# EAGLE design riffle-CT-beta-0.1.0 (EAGLE 7.3.0)
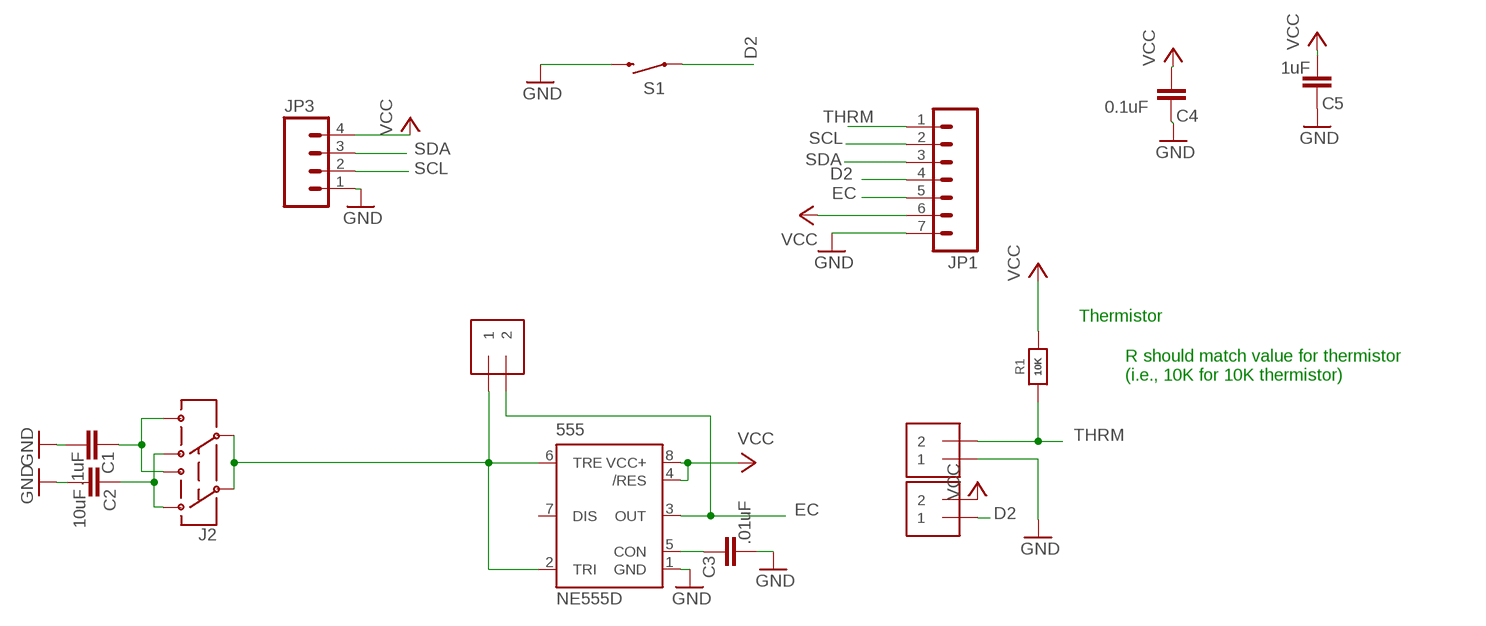
[diagram p0: schematic, sheet 1]

## Parts
1W  1X2-3.5MM  [1X2-3.5MM]
555  NE555D  [SO08@1]
C1  .1uF  CAP0603-CAP  [0603-CAP]
C2  10uF  CAP0603-CAP  [0603-CAP]
C3  .01uF  CAP0603-CAP  [0603-CAP]
C4  0.1uF  CAP0603-CAP  [0603-CAP]
C5  1uF  CAP0603-CAP  [0603-CAP]
EC  1X2-3.5MM  [1X2-3.5MM]
J2  AYZ0202  [AYZ0202]
JP1  M07  [1X07]
JP3  M04SMD  [1X04-SMD]
R1  10K  RESISTOR_0603_NOOUT  [0603-NO]
S1  REED  SWITCH-MOMENTARY-2PTH_REED2  [REED_SWITCH_PLASTIC]
THRM  1X2-3.5MM  [1X2-3.5MM]

## Nets
D2: 1W.1 JP1.4 S1.P$1
EC: 555.3(OUT) EC.2 JP1.5
GND: 555.1(GND) C1.1 C2.1 C3.1 C4.2 C5.2 JP1.7 JP3.1 S1.P$2 THRM.1
N1: 555.2(TRI) 555.6(TRE) EC.1 J2.2 J2.5
N$1: 555.5(CON) C3.2
N$6: C2.2 J2.3 J2.6
SCL: JP1.2 JP3.2
SDA: JP1.3 JP3.3
THRM: JP1.1 R1.1 THRM.2
VCC: 1W.2 555.4(/RES) 555.8(VCC+) C4.1 C5.1 JP1.6 JP3.4 R1.2
VDD2: C1.2 J2.1 J2.4
Unconnected: 555.7(DIS)

## Notes on the sheet
- Thermistor
- R should match value for thermistor
  (i.e., 10K for 10K thermistor)

## Library data of the parts
1W EC THRM = adafruit:1X2: 3.5mm Terminal block http://www.ladyada.net/library/pcb/eaglelibrary.html
555 = SparkFun-AnalogIC:NE555: General purpose bipolar Timer
C1-C5 = SparkFun:CAP: Capacitor Standard 0603 ceramic capacitor, and 0.1" leaded capacitor.
J2 = SparkFunNew:AYZ0202: SPDT Slide Switch Simple SMD single-pull double-throw slide switch. Good for less than 350mA power switch, switching UARTs between devices, etc. Spark Fun Electronics SKU : COM-00597
JP1 = SparkFun-Connectors:M07: Header 7 Standard 7-pin 0.1" header. Use with straight break away headers (SKU : PRT-00116), right angle break away headers (PRT-00553), swiss pins (PRT-00743), machine pins (PRT-00117), and female headers (PRT-00115). NOTES ON THE VARIANTS LOCK and LOCK_LONGPADS... This footprint was designed to help hold the alignment of a through-hole component (i.e. 7-pin header) while soldering it into place. You may notice that each hole has been shifted either up or down by 0.005 of an inch from it's more standard position (which is usually a perfectly straight line). This slight alteration caused the pins (the squares in the middle) to touch the edges of the holes. Because they are alternating, it causes a "brace" to hold the header in place. 0.005 has proven to be the perfect amount of "off-center" position when using our standard breakaway headers. Although looks a little odd when you look at the bare footprint, once you have a header in there, the alteration is very hard to notice. Also, if you push a header all the way into place, it is covered up entirely on the bottom side. This idea of altering the position of holes to aid alignment will be further integrated into the Sparkfun Library for other footprints. It can help hold any component with 3 or more connection pins.
JP3 = SparkFun:M04: Header 4 Standard 4-pin 0.1" header. Use with straight break away headers (SKU : PRT-00116), right angle break away headers (PRT-00553), swiss pins (PRT-00743), machine pins (PRT-00117), and female headers (PRT-00115). Molex polarized connector foot print use with SKU : PRT-08231 with associated crimp pins and housings.
R1 = microbuilder:RESISTOR: Resistors For new designs, use the packages preceded by an '_' character since they are more reliable: The following footprints should be used on most boards: _0402 - Standard footprint for regular board layouts _0603 - Standard footprint for regular board layouts _0805 - Standard footprint for regular board layouts _1206 - Standard footprint for regular board layouts For extremely tight-pitch boards where space is at a premium, the following 'micro-pitch' footprints can be used (smaller pads, no silkscreen outline, etc.): _0402MP - Micro-pitch footprint for very dense/compact boards _0603MP - Micro-pitch footprint for very dense/compact boards _0805MP - Micro-pitch footprint for very dense/compact boards _1206MP - Micro-pitch footprint for very dense/compact boards
S1 = SparkFun-Electromechanical:SWITCH-MOMENTARY-2: Various NO switches- pushbuttons, reed, etc; PROD_ID: SWCH-10467

## Board
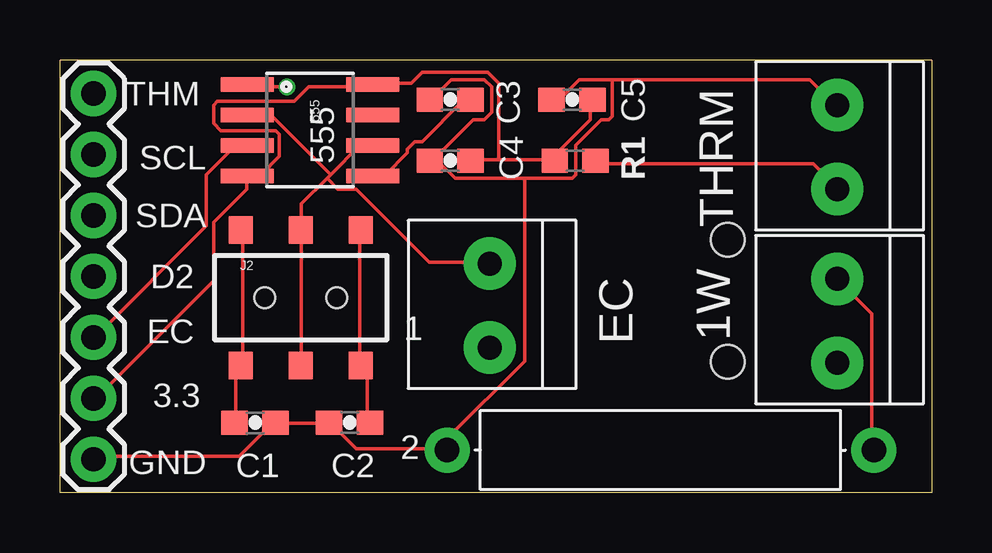
[diagram p1: board, top side]
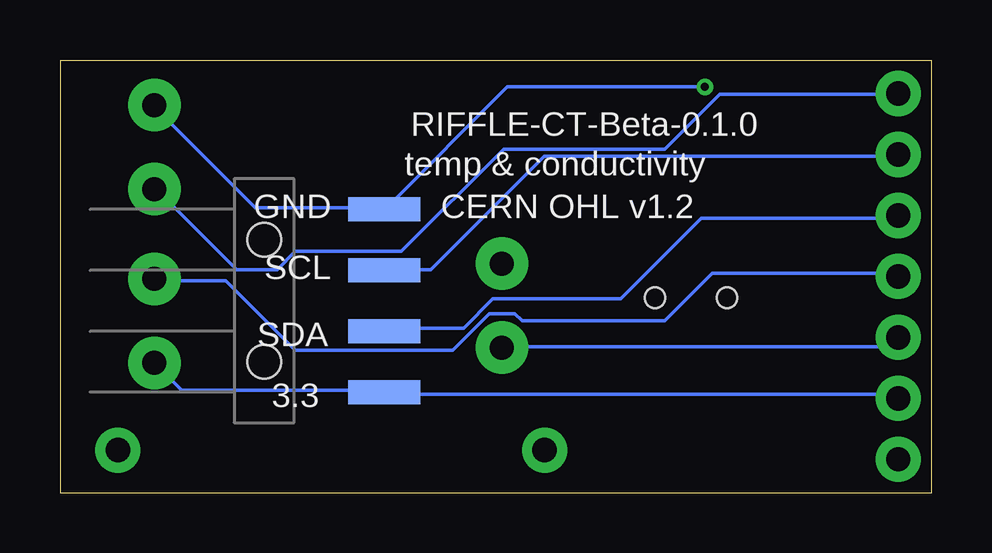
[diagram p2: board, bottom side, seen from below]

Size 36.32 x 18.03 mm. Coordinates in mm from the lower left corner, seen from the top.
Outline: 36.32,0 0,0 0,18.03 36.32,18.03 36.32,0
Copper layers (1*16): Top 0.0356mm / dielectric 1.5011mm / Bottom 0.0356mm
Design rules "LaenPCBOrder": minimum track width 6mil, minimum drill 13mil, track to track 6mil, track to pad 6mil, pad to pad 6mil, via to via 6mil, smd to smd 6mil, copper to edge 15mil, drill to drill 6mil, minimum pad ring 7mil, minimum via ring 7mil, stop-mask expansion 3mil, vias tented up to drill 0mil, thermal gap 10mil

### Footprints (pad centres in the part's own frame; a part is rotated, then mirrored left to right if it is on the bottom)
1X2-3.5MM = drill 1 pad 2.184: 1 1.8,0; 2 -1.7,0
SO08@1 = smd 0.61 x 2.21: 1 -1.905,-2.616; 2 -0.635,-2.616; 3 0.635,-2.616; 4 1.905,-2.616; 5 1.905,2.616; 6 0.635,2.616; 7 -0.635,2.616; 8 -1.905,2.616
0603-CAP = smd 1.1 x 1: 1 -0.85,0; 2 0.85,0
AYZ0202 = smd 1 x 1.15: 1 -2.5,2.825; 2 0,2.825; 3 2.5,2.825; 4 -2.5,-2.825; 5 0,-2.825; 6 2.5,-2.825 | hole 0.85: 1.5,0; -1.5,0
1X07 = drill 1.016 pad 1.88: 1 0,0; 2 2.54,0; 3 5.08,0; 4 7.62,0; 5 10.16,0; 6 12.7,0; 7 15.24,0
1X04-SMD = smd 1 x 3: 1 -3.81,5; 2 -1.27,5; 3 1.27,5; 4 3.81,5 | hole 1.4: -2.54,0; 2.54,0
0603-NO = smd 1.1 x 1: 1 -0.85,0; 2 0.85,0
REED_SWITCH_PLASTIC = drill 1.016 pad 1.88: P$1 -8.89,0; P$2 8.89,0

### Placement (x,y rotation side)
1W  32.38,7.11 90 top
555  10.41,15.11 270 top
C1  8.13,2.92 180 top
C2  12.06,2.92 0 top
C3  16.26,16.38 0 top
C4  16.26,13.84 180 top
C5  21.34,16.38 180 top
EC  17.91,7.75 90 top
J2  10.03,8.13 0 top
JP1  1.4,16.64 270 top
JP3  27.81,8 270 bottom
R1  21.46,13.84 180 top
S1  25.02,1.78 180 top
THRM  32.38,14.35 90 top

### Tracks (layer width: path | path; a pad name or v marks a point on that pad's centre or on a via)
D2
  Top 0.152: S1.P$1 33.83,1.83 33.83,7.47 32.46,8.84 1W.1
  Bottom 0.152: JP1.4 1.52,9.14 9.14,9.14 11.12,7.16 17.07,7.16 17.37,7.47 18.44,7.47 19.96,5.94 26.52,5.94 29.41,8.84 32.31,8.84 1W.1
EC
  Top 0.152: 555.3 7.32,14.48 6.1,13.26 6.1,11.12 1.52,6.55 JP1.5
  Bottom 0.152: EC.2 17.83,6.1 1.83,6.1 1.52,6.4 JP1.5
GND  (via drill 0.33)
  Top 0.152: 7.77,17.07 555.1 7.92,16.92 v9.45,16.92 | JP1.7 1.52,1.52 7.47,1.52 8.84,2.9 C1.1 8.99,2.9 11.12,2.9 C2.1 11.28,2.9 12.34,1.83 16,1.83 S1.P$2 16.15,1.83 16.15,2.29 19.36,5.49 19.36,13.11 | C3.1 15.54,16.46 16.31,17.22 17.68,17.22 17.98,16.92 17.98,15.85 17.68,15.54 17.22,15.54 15.54,13.87 C4.2 15.54,13.72 15.85,13.72 16.46,13.11 19.36,13.11 | 23.01,17.22 31.24,17.22 32.31,16.15 THRM.1 | 23.01,17.22 21.64,17.22 20.88,16.46 20.57,16.46 C5.2 | 19.36,13.11 21.34,13.11 21.49,13.26 21.49,14.48 22.55,15.54 22.86,15.54 23.01,15.7 23.01,17.22
  Bottom 0.152: v9.45,16.92 17.68,16.92 22.71,11.89 JP3.1 22.86,11.89 28.19,11.89 32.31,16 THRM.1
N1
  Top 0.152: J2.5 10.06,5.33 10.06,10.82 J2.2 10.06,10.97 10.06,12.04 11.12,13.11 | 555.6 12.5,14.48 11.28,13.26 | 11.12,13.11 11.28,13.26 | 11.28,13.26 8.84,15.7 7.92,15.7 555.2 | 11.12,13.11 11.58,12.65 12.34,12.65 15.39,9.6 17.83,9.6 EC.1
N$1
  Top 0.152: C3.2 17.07,16.31 16.76,16.31 15.09,14.63 14.78,14.63 14.48,14.33 14.48,14.17 13.56,13.26 13.11,13.26 555.5
N$6
  Top 0.152: C2.2 12.8,3.05 12.8,5.03 12.65,5.18 J2.6 12.5,5.33 12.5,10.82 J2.3
SCL
  Bottom 0.152: JP3.2 22.71,9.3 20.88,9.3 16.15,14.02 1.52,14.02 JP1.2
SDA
  Bottom 0.152: JP3.3 22.71,6.86 19.51,6.86 18.29,8.08 12.95,8.08 9.6,11.43 1.52,11.43 JP1.3
THRM
  Top 0.152: R1.1 22.4,13.72 31.39,13.72 32.31,12.8 THRM.2
  Bottom 0.152: JP1.1 1.52,16.61 8.84,16.61 11.12,14.33 17.83,14.33 22.1,10.06 26.52,10.06 27.28,9.3 28.96,9.3 32.31,12.65 THRM.2
VCC
  Top 0.152: 20.42,13.87 20.57,13.87 R1.2 20.42,13.87 | 20.42,13.87 18.29,13.87 | 18.29,13.87 17.22,13.87 C4.1 | 20.42,13.87 22.1,15.54 22.1,16.31 C5.1 | 18.29,13.87 18.29,17.07 17.83,17.53 15.09,17.53 14.63,17.07 13.11,17.07 555.8 12.95,16.92 10.36,16.92 9.75,16.31 6.55,16.31 6.4,16.15 6.4,15.39 6.71,15.09 8.99,15.09 9.14,14.94 9.14,14.02 8.38,13.26 7.92,13.26 555.4 7.77,13.11 7.77,12.65 6.4,11.28 6.4,8.84 1.52,3.96 JP1.6
  Bottom 0.152: 1W.2 32.31,5.33 31.24,4.27 22.86,4.27 JP3.4 22.71,4.12 1.68,4.12 1.52,3.96 JP1.6
VDD2
  Top 0.152: C1.2 7.32,3.05 7.32,5.03 7.47,5.18 J2.4 7.62,5.33 7.62,10.82 J2.1

### Text on the board
tPlace: THM | SCL | 555 | SDA | D2 | EC | 1 | 3.3 | GND | 2
bPlace: RIFFLE-CT-Beta-0.1.0 | temp & conductivity | GND | CERN OHL v1.2 | SCL | SDA | 3.3